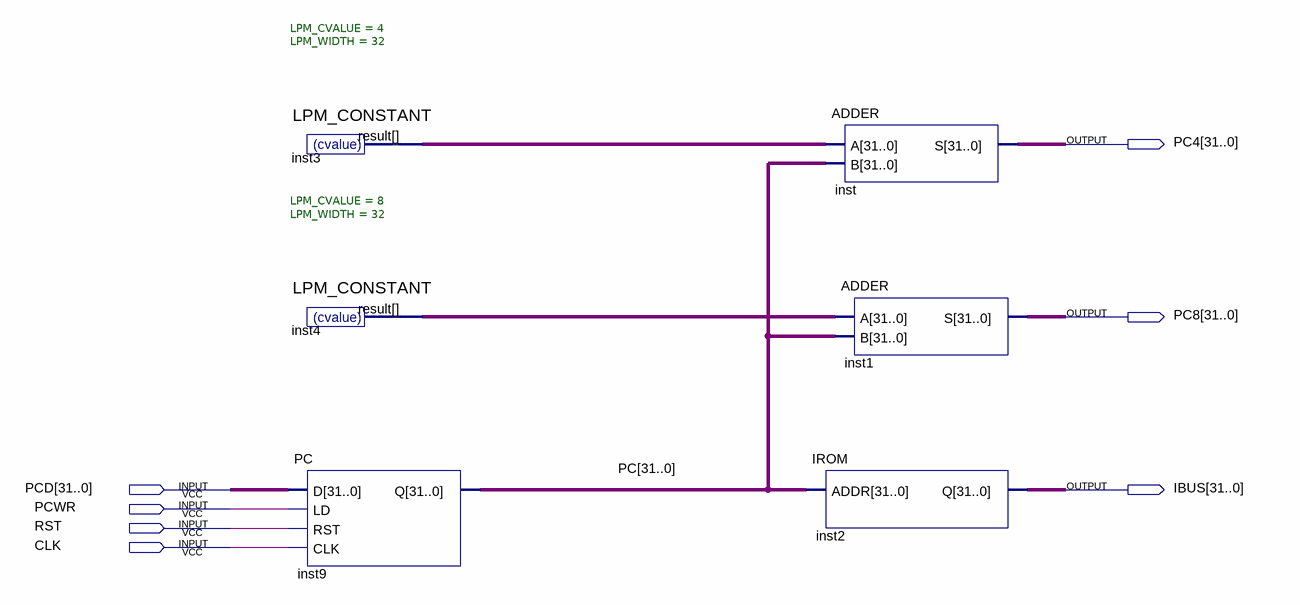
[diagram p0: schematic sheet]
// Quartus schematic fetch.bdf as structural Verilog: 6 symbols, 7 pins
module fetch (
  input  [31:0] PCD,
  input  PCWR,
  input  RST,
  input  CLK,
  output [31:0] PC4,
  output [31:0] PC8,
  output [31:0] IBUS
);

  wire [31:0] inst3_result, inst4_result, PC;

  LPM_CONSTANT #(.LPM_CVALUE(4), .LPM_WIDTH(32)) inst3 (.result(inst3_result));
  LPM_CONSTANT #(.LPM_CVALUE(8), .LPM_WIDTH(32)) inst4 (.result(inst4_result));
  PC inst9 (.D(PCD), .LD(PCWR), .RST(RST), .CLK(CLK), .Q(PC));
  IROM inst2 (.ADDR(PC), .Q(IBUS));
  ADDER inst (.A(inst3_result), .B(PC), .S(PC4));
  ADDER inst1 (.A(inst4_result), .B(PC), .S(PC8));
endmodule
